# Altium schematic sheet MIDI_CV_Converter.SchDoc: Backplane: MIDI-CV Converter Connector
size Letter; Engineer: Nicholas Morrow; Project: GARY Synthesizer
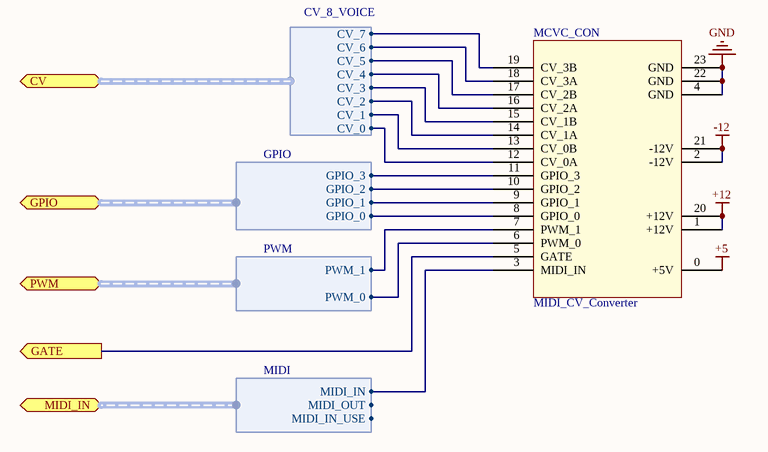
[diagram p0: MIDI_CV_Converter.SchDoc]

## Parts
MCVC_CON  MIDI_CV_Converter  [MIDI-CV CONVERTER SOCKET]

## Ports
CV (harness CV_8_VOICE), GATE (out), GPIO (harness GPIO), MIDI_IN (harness MIDI), PWM (harness PWM)

## Harnesses
CV_8_VOICE: CV_0, CV_2, CV_4, CV_6, CV_1, CV_3, CV_5, CV_7
MIDI: MIDI_IN, MIDI_OUT, MIDI_IN_USE
GPIO: GPIO_0, GPIO_1, GPIO_2, GPIO_3
PWM: PWM_0, PWM_1

## Nets
+5: MCVC_CON.0(+5V)
+12: MCVC_CON.1(+12V) MCVC_CON.20(+12V)
-12: MCVC_CON.2(-12V) MCVC_CON.21(-12V)
GND: MCVC_CON.4(GND) MCVC_CON.22(GND) MCVC_CON.23(GND)
GATE: MCVC_CON.5(GATE) ; port GATE
NetMCVC_CON_3: MCVC_CON.3(MIDI_IN) ; port MIDI_IN.MIDI_IN
NetMCVC_CON_6: MCVC_CON.6(PWM_0) ; port PWM.PWM_0
NetMCVC_CON_7: MCVC_CON.7(PWM_1) ; port PWM.PWM_1
NetMCVC_CON_8: MCVC_CON.8(GPIO_0) ; port GPIO.GPIO_0
NetMCVC_CON_9: MCVC_CON.9(GPIO_1) ; port GPIO.GPIO_1
NetMCVC_CON_10: MCVC_CON.10(GPIO_2) ; port GPIO.GPIO_2
NetMCVC_CON_11: MCVC_CON.11(GPIO_3) ; port GPIO.GPIO_3
NetMCVC_CON_12: MCVC_CON.12(CV_0A) ; port CV.CV_0
NetMCVC_CON_13: MCVC_CON.13(CV_0B) ; port CV.CV_1
NetMCVC_CON_14: MCVC_CON.14(CV_1A) ; port CV.CV_2
NetMCVC_CON_15: MCVC_CON.15(CV_1B) ; port CV.CV_3
NetMCVC_CON_16: MCVC_CON.16(CV_2A) ; port CV.CV_4
NetMCVC_CON_17: MCVC_CON.17(CV_2B) ; port CV.CV_5
NetMCVC_CON_18: MCVC_CON.18(CV_3A) ; port CV.CV_6
NetMCVC_CON_19: MCVC_CON.19(CV_3B) ; port CV.CV_7

## Notes on the sheet
- Notes:
- Title:
- Size:
- Project:
- Letter
- Number:
- Revision:
- Date:
- Engineer:
- Sheet:
- of